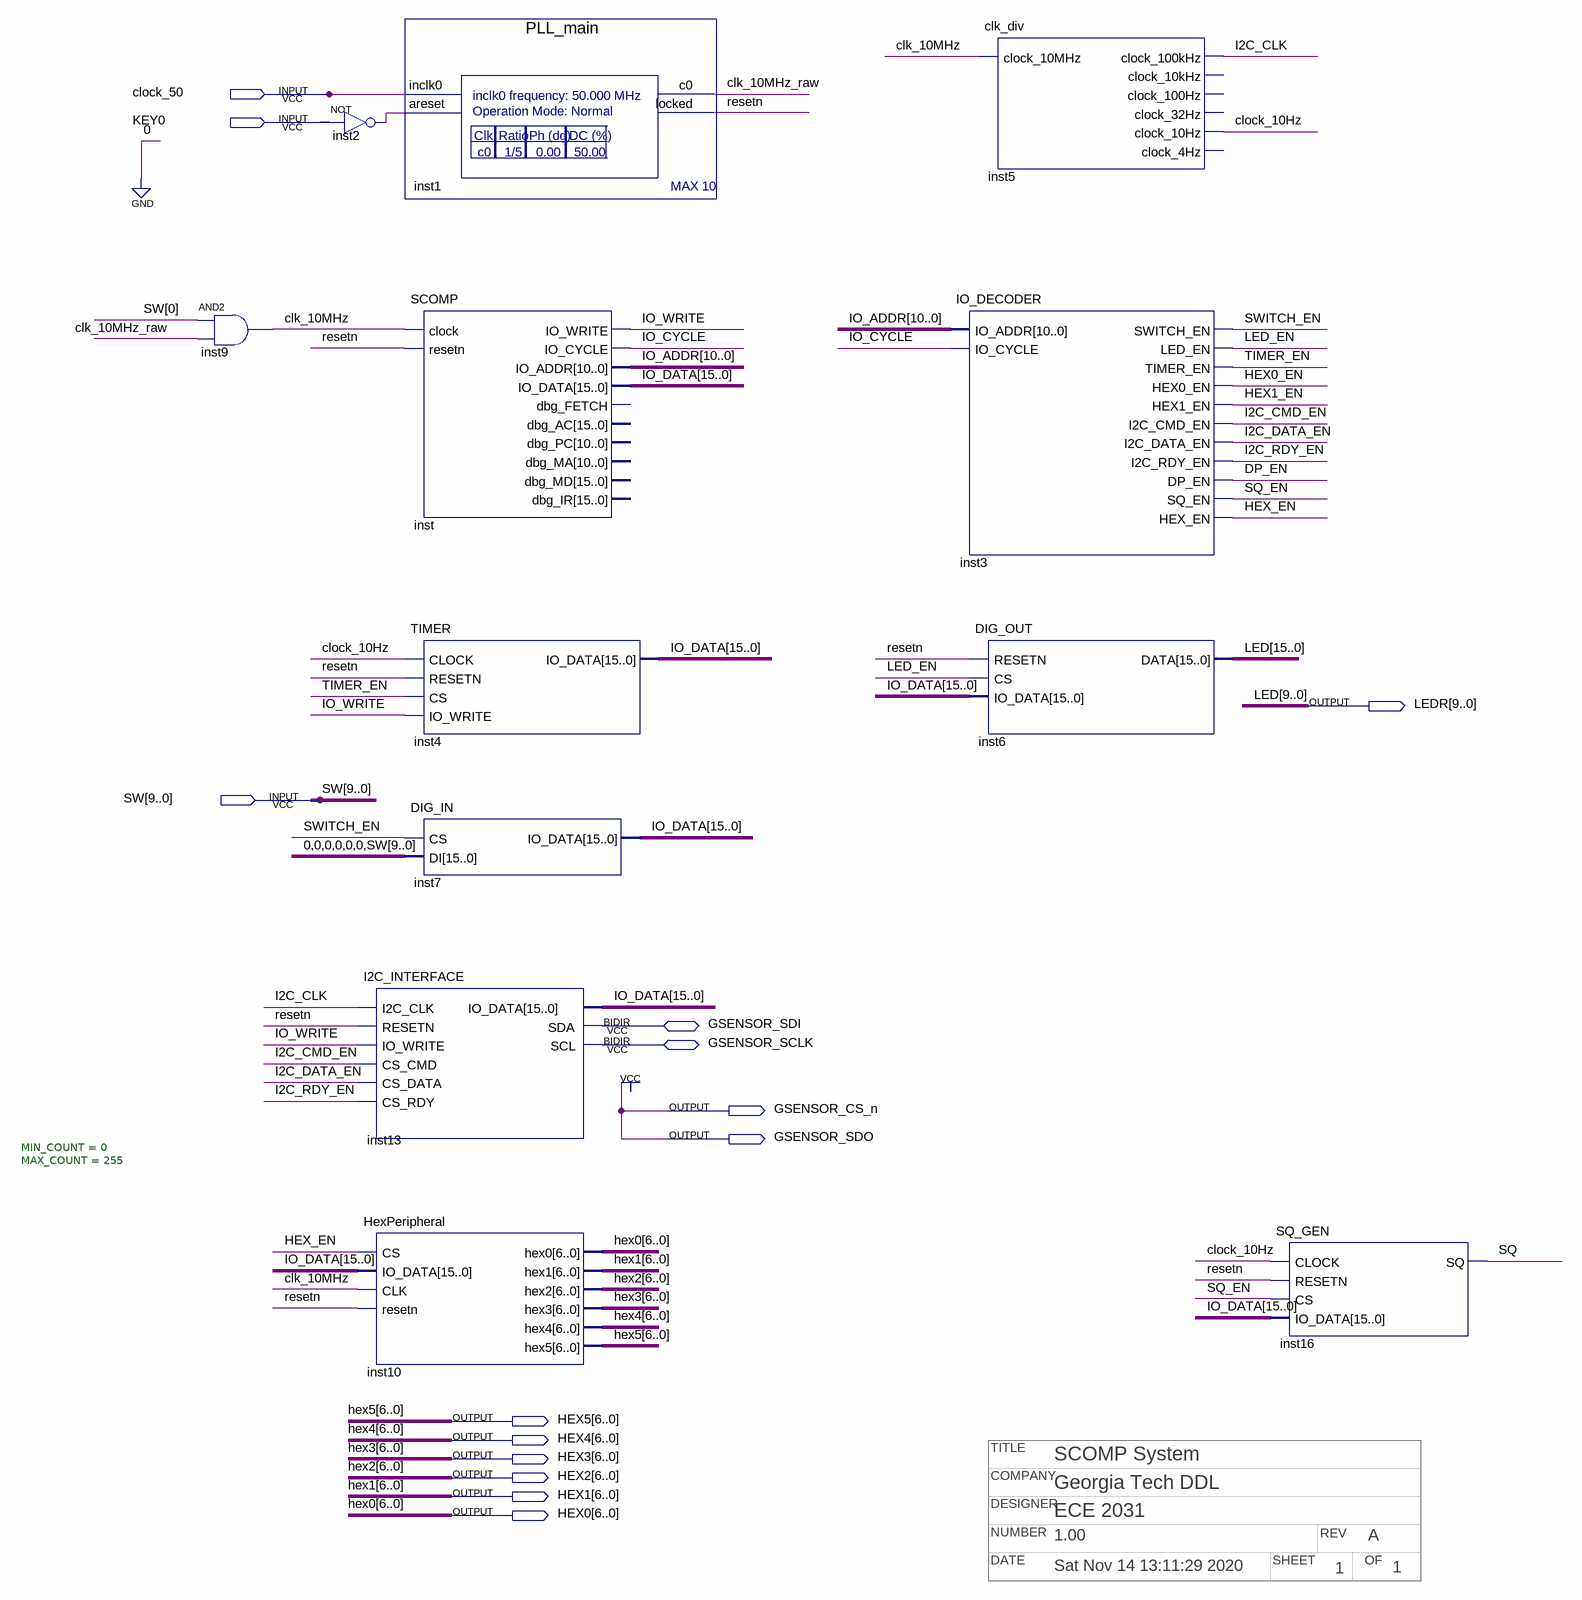
[diagram p0: schematic sheet]
// Quartus schematic SCOMP_System.bdf as structural Verilog: 12 symbols, 14 pins
// Title block: TITLE: SCOMP System; COMPANY: Georgia Tech DDL; DESIGNER: ECE 2031; NUMBER: 1.00; REV: A; DATE: Sat Nov 14 13:11:29 2020; SHEET: 1; OF: 1
module SCOMP_System (
  input  clock_50,
  input  KEY0,
  input  [9:0] SW,
  inout  GSENSOR_SDI,
  inout  GSENSOR_SCLK,
  output [9:0] LEDR,
  output GSENSOR_CS_n,
  output GSENSOR_SDO,
  output [6:0] HEX5,
  output [6:0] HEX4,
  output [6:0] HEX3,
  output [6:0] HEX2,
  output [6:0] HEX1,
  output [6:0] HEX0
);

  wire clk_10MHz, clk_10MHz_raw, clock_10Hz, DP_EN, HEX0_EN, HEX1_EN, HEX_EN, I2C_CLK, I2C_CMD_EN,
       I2C_DATA_EN, I2C_RDY_EN, inst2_out, IO_CYCLE, IO_WRITE, LED_EN, resetn, SQ, SQ_EN, SWITCH_EN, TIMER_EN;
  wire [10:0] IO_ADDR;
  wire [15:0] IO_DATA;
  wire [15:10] LED;

  and inst9 (clk_10MHz, SW[0], clk_10MHz_raw);
  not inst2 (inst2_out, KEY0);
  I2C_INTERFACE inst13 (
    .I2C_CLK(I2C_CLK), .RESETN(resetn), .IO_WRITE(IO_WRITE), .CS_CMD(I2C_CMD_EN), .CS_DATA(I2C_DATA_EN),
    .CS_RDY(I2C_RDY_EN), .IO_DATA(IO_DATA), .SDA(GSENSOR_SDI), .SCL(GSENSOR_SCLK));
  HexPeripheral #(.MIN_COUNT(0), .MAX_COUNT(255)) inst10 (
    .CS(HEX_EN), .IO_DATA(IO_DATA), .CLK(clk_10MHz), .resetn(resetn), .hex0(HEX0), .hex1(HEX1), .hex2(HEX2),
    .hex3(HEX3), .hex4(HEX4), .hex5(HEX5));
  PLL_main inst1 (.inclk0(clock_50), .areset(inst2_out), .c0(clk_10MHz_raw), .locked(resetn));
  SCOMP inst (
    .clock(clk_10MHz), .resetn(resetn), .IO_WRITE(IO_WRITE), .IO_CYCLE(IO_CYCLE), .IO_ADDR(IO_ADDR),
    .IO_DATA(IO_DATA));  // open: dbg_FETCH, dbg_AC, dbg_PC, dbg_MA, dbg_MD, dbg_IR
  TIMER inst4 (.CLOCK(clock_10Hz), .RESETN(resetn), .CS(TIMER_EN), .IO_WRITE(IO_WRITE), .IO_DATA(IO_DATA));
  DIG_IN inst7 (.CS(SWITCH_EN), .DI({{6{1'b0}}, SW}), .IO_DATA(IO_DATA));
  clk_div inst5 (
    .clock_10MHz(clk_10MHz), .clock_100kHz(I2C_CLK), .clock_10Hz(clock_10Hz));  // open: clock_10kHz, clock_100Hz, clock_32Hz, clock_4Hz
  IO_DECODER inst3 (
    .IO_ADDR(IO_ADDR), .IO_CYCLE(IO_CYCLE), .SWITCH_EN(SWITCH_EN), .LED_EN(LED_EN), .TIMER_EN(TIMER_EN),
    .HEX0_EN(HEX0_EN), .HEX1_EN(HEX1_EN), .I2C_CMD_EN(I2C_CMD_EN), .I2C_DATA_EN(I2C_DATA_EN),
    .I2C_RDY_EN(I2C_RDY_EN), .DP_EN(DP_EN), .SQ_EN(SQ_EN), .HEX_EN(HEX_EN));
  DIG_OUT inst6 (.RESETN(resetn), .CS(LED_EN), .IO_DATA(IO_DATA), .DATA({LED, LEDR}));
  SQ_GEN inst16 (.CLOCK(clock_10Hz), .RESETN(resetn), .CS(SQ_EN), .IO_DATA(IO_DATA), .SQ(SQ));

  assign GSENSOR_CS_n = 1'b1;
  assign GSENSOR_SDO = 1'b1;

  // Other names for the same wires on the sheet: LED[9:0] = LEDR
endmodule
